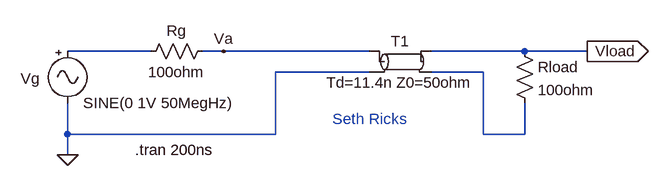
[diagram p0: schematic LTspice Transmission Line Lab.asc]
LTspice Transmission Line Lab.asc, the LTspice schematic file:
Version 4
SHEET 1 880 680
WIRE -208 80 -336 80
WIRE -96 80 -128 80
WIRE 128 80 -96 80
WIRE 368 80 224 80
WIRE 464 80 368 80
WIRE 128 112 -16 112
WIRE 304 112 224 112
WIRE -336 208 -336 160
WIRE -16 208 -16 112
WIRE -16 208 -336 208
WIRE 304 208 304 112
WIRE 368 208 368 160
WIRE 368 208 304 208
WIRE -336 240 -336 208
FLAG -336 240 0
FLAG -96 80 Va
FLAG 464 80 Vload
IOPIN 464 80 Out
SYMBOL tline 176 96 R0
SYMATTR InstName T1
SYMATTR Value Td=11.4n Z0=50ohm
SYMBOL Misc\\signal -336 64 R0
WINDOW 0 -72 58 Left 2
WINDOW 123 0 0 Left 0
WINDOW 39 0 0 Left 0
SYMATTR InstName Vg
SYMATTR Value SINE(0 1V 50MegHz)
SYMBOL res -112 64 R90
WINDOW 0 0 56 VBottom 2
WINDOW 3 32 56 VTop 2
SYMATTR InstName Rg
SYMATTR Value 100ohm
SYMBOL res 352 64 R0
SYMATTR InstName Rload
SYMATTR Value 100ohm
TEXT 72 184 Left 2 ;Seth Ricks
TEXT -232 232 Left 2 !.tran 200ns

The netlist it stands for:
* LTspice Transmission Line Lab.asc
T1 Va 0 Vload N002 Td=11.4n Z0=50ohm
Vg N001 0 SINE(0 1V 50MegHz)
Rg Va N001 100ohm
Rload Vload N002 100ohm
* Seth Ricks
.tran 200ns
.backanno
.end